# EAGLE schematic SensorTile_CR2032_V01 (EAGLE 9.0.1)
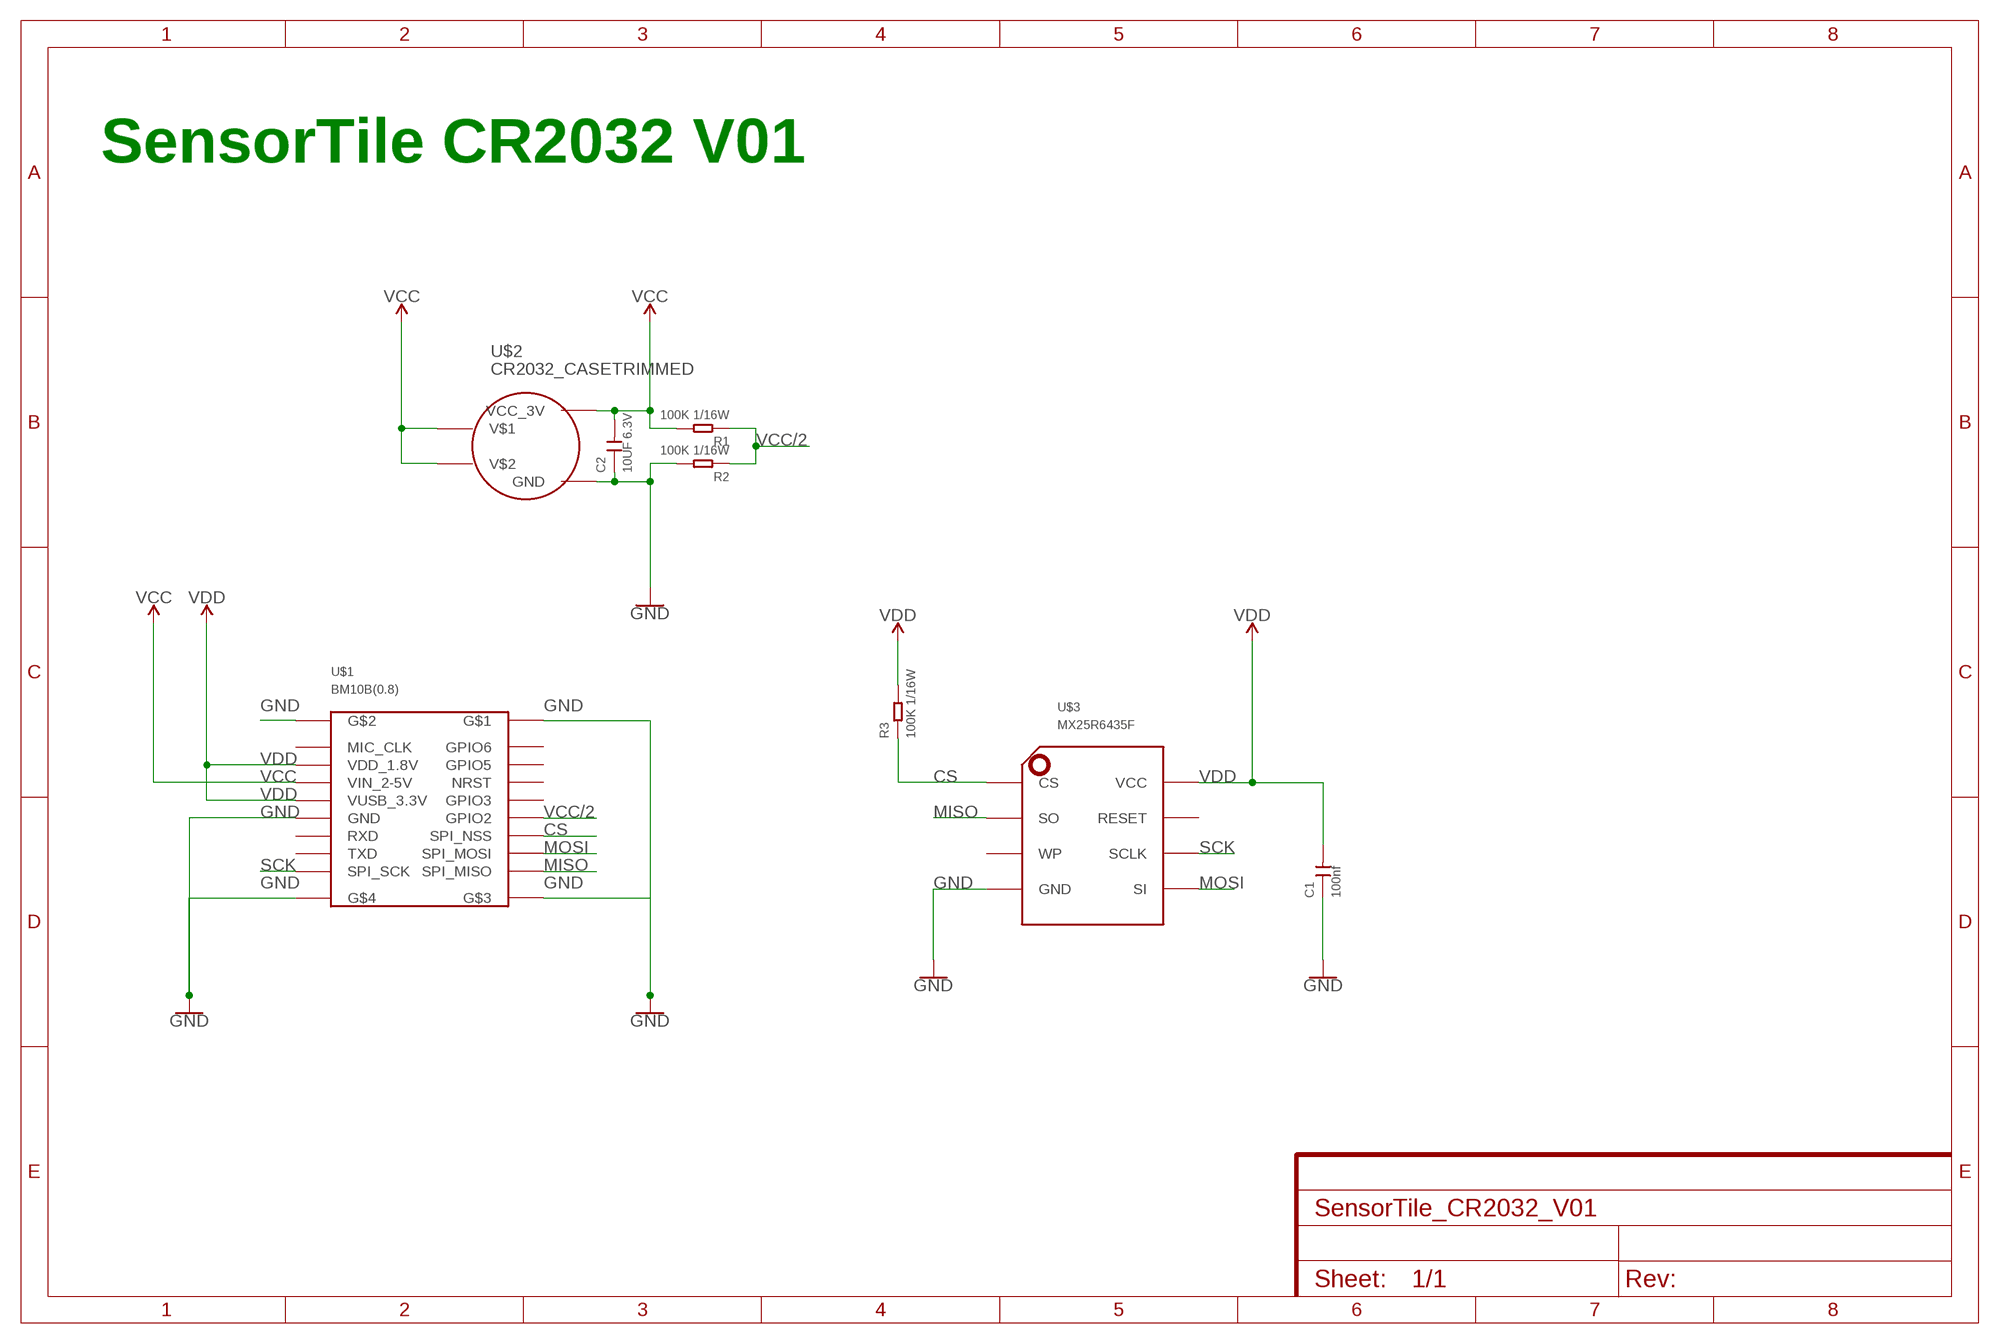
[diagram p0: schematic, sheet 1]

## Parts
C1  100nf  CERAMIC-100NF-25V-10%-X7R(0402)  [C0402]
C2  10UF 6.3V  CERAMIC-10UF-6.3V-20%-X5R(0603)  [C0603]
R1  100K 1/16W  SMD-RES-100K-5%-1/16W(0402)  [R0402]
R2  100K 1/16W  SMD-RES-100K-5%-1/16W(0402)  [R0402]
R3  100K 1/16W  SMD-RES-10K-1%-1/16W(0402)  [R0402]
U$1  BM10B(0.8)  BM10B(0.8)-16DP-0.4V(51)  [BM10B(0.8)-16DP-0.4V(51)]
U$2  CR2032_CASETRIMMED  [CR2032_CASE_TRIMMED]
U$3  MX25R6435F  [8-USON_MX25R6435F]

## Nets
CS: R3.1 U$1.SPI_NSS U$3.CS$1(CS)
GND: C1.1 C2.1 R2.2 U$1.G$1 U$1.G$2 U$1.G$3 U$1.G$4 U$1.GND$1(GND) U$2.GND U$3.GND$4(GND)
MISO: U$1.SPI_MISO U$3.SO$2(SO)
MOSI: U$1.SPI_MOSI U$3.SI$5(SI)
SCK: U$1.SPI_SCK U$3.SCLK$6(SCLK)
VCC: C2.2 R1.2 U$1.VIN_2-5V U$2.VCC@1(V$1) U$2.VCC@2(V$2) U$2.VCC_3V
VCC/2: R1.1 R2.1 U$1.GPIO2
VDD: C1.2 R3.2 U$1.VDD_1.8V U$1.VUSB_3.3V U$3.VCC$8(VCC)
Unconnected: U$1.GPIO3 U$1.GPIO5 U$1.GPIO6 U$1.MIC_CLK U$1.NRST U$1.RXD U$1.TXD U$3.RESET$7(RESET) U$3.WP$3(WP)

## Notes on the sheet
- SensorTile CR2032 V01

## Library data of the parts
C1 = Seeed-Capacitor-2016:CERAMIC-100NF-25V-10%-X7R(0402): 302010024; MPN: CC0402KRX7R8BB104
C2 = Seeed-Capacitor-2016:CERAMIC-10UF-6.3V-20%-X5R(0603): 302010286; MPN: CC0603MRX5R5BB106
R1 R2 = Seeed-Resistor-2016:SMD-RES-100K-5%-1/16W(0402): 301010033; MPN: RC0402JR-07100KL
R3 = Seeed-Resistor-2016:SMD-RES-10K-1%-1/16W(0402): 301010047; MPN: RC0402FR-0710KL; VALUE: 10K 1/16W
U$1 = BM10B(0.8):BM10B(0.8)-16DP-0.4V(51)
U$2 = CR2032:CR2032_CASE: CR2032_Case Digikey:‏‎BK-915-CT-ND‎‏
U$3 = MX25R6435F:MX25R6435F: MX25R6435F Digikey: ‎1092-1173-ND‎‏